# Altium project Telemetria_Oficial.PrjPcb
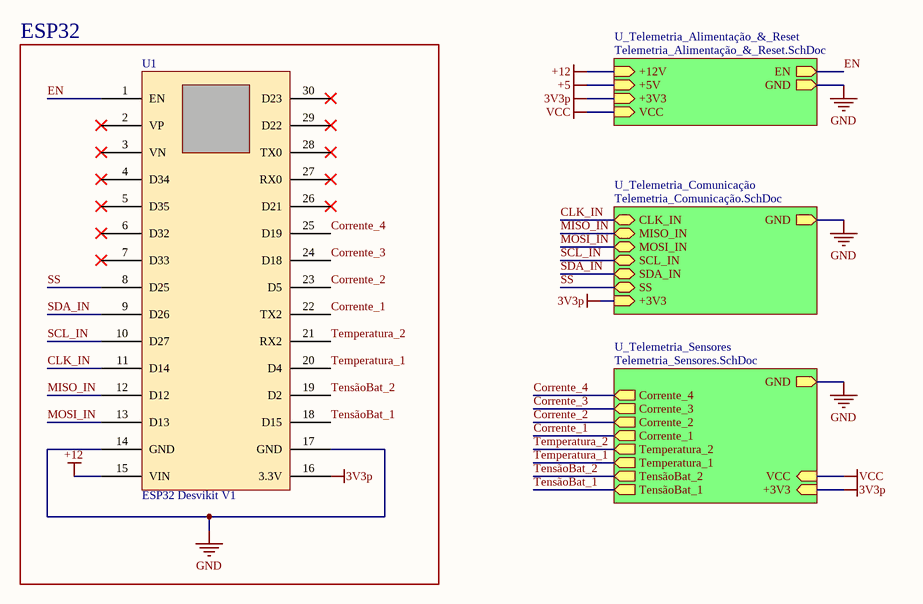
[diagram p0: Telemetria_Oficial.SchDoc]
4 sheets, 27 parts. Net scope: hierarchical (ports join the sheet entries above them; power ports are global).
Board file: Telemetria_Oficial.PcbDoc
Sheets:
  Telemetria_Oficial.SchDoc
    U_Telemetria_Alimentação_&_Reset = Telemetria_Alimentação_&_Reset.SchDoc
    U_Telemetria_Comunicação = Telemetria_Comunicação.SchDoc
    U_Telemetria_Sensores = Telemetria_Sensores.SchDoc

## Sheet Telemetria_Oficial.SchDoc
size A4; SheetNumber: 1; SheetTotal: 4

### Parts
U1  value ESP32 Desvikit V1  [ESP32_Desvikit_v1]  (hidden comment: microcontrolador)

### Blocks framed on the sheet
ESP32: U1

### Sub-sheets
U_Telemetria_Alimentação_&_Reset = Telemetria_Alimentação_&_Reset.SchDoc: EN (out), GND (out), +12V (in), +5V (in), +3V3 (in), VCC (in)
U_Telemetria_Comunicação = Telemetria_Comunicação.SchDoc: CLK_IN (bidir), MISO_IN (bidir), MOSI_IN (bidir), SCL_IN (bidir), SDA_IN (bidir), SS (bidir), GND (out), +3V3 (in)
U_Telemetria_Sensores = Telemetria_Sensores.SchDoc: TensãoBat_1 (out), TensãoBat_2 (out), Temperatura_1 (out), Temperatura_2 (out), Corrente_1 (out), Corrente_2 (out), Corrente_3 (out), Corrente_4 (out), GND (out), +3V3 (in), VCC (in)

### Nets
3V3p: U1.16(3.3V) ; sheet U_Telemetria_Alimentação_&_Reset/+3V3, sheet U_Telemetria_Comunicação/+3V3, sheet U_Telemetria_Sensores/+3V3  [project net +3V3]
+12: U1.15(VIN) ; sheet U_Telemetria_Alimentação_&_Reset/+12V  [project net +12V]
GND: U1.14(GND) U1.17(GND) ; sheet U_Telemetria_Alimentação_&_Reset/GND, sheet U_Telemetria_Comunicação/GND, sheet U_Telemetria_Sensores/GND
VCC: sheet U_Telemetria_Alimentação_&_Reset/VCC, sheet U_Telemetria_Sensores/VCC
CLK_IN: U1.11(D14) ; sheet U_Telemetria_Comunicação/CLK_IN
Corrente_1: U1.22(TX2) ; sheet U_Telemetria_Sensores/Corrente_1
Corrente_2: U1.23(D5) ; sheet U_Telemetria_Sensores/Corrente_2
Corrente_3: U1.24(D18) ; sheet U_Telemetria_Sensores/Corrente_3
Corrente_4: U1.25(D19) ; sheet U_Telemetria_Sensores/Corrente_4
EN: U1.1(EN) ; sheet U_Telemetria_Alimentação_&_Reset/EN
MISO_IN: U1.12(D12) ; sheet U_Telemetria_Comunicação/MISO_IN
MOSI_IN: U1.13(D13) ; sheet U_Telemetria_Comunicação/MOSI_IN
SCL_IN: U1.10(D27) ; sheet U_Telemetria_Comunicação/SCL_IN
SDA_IN: U1.9(D26) ; sheet U_Telemetria_Comunicação/SDA_IN
SS: U1.8(D25) ; sheet U_Telemetria_Comunicação/SS
Temperatura_1: U1.20(D4) ; sheet U_Telemetria_Sensores/Temperatura_1
Temperatura_2: U1.21(RX2) ; sheet U_Telemetria_Sensores/Temperatura_2
TensãoBat_1: U1.18(D15) ; sheet U_Telemetria_Sensores/TensãoBat_1
TensãoBat_2: U1.19(D2) ; sheet U_Telemetria_Sensores/TensãoBat_2

Not connected (* = marked no-connect by the designer): U1 2(VP)* 3(VN)* 4(D34)* 5(D35)* 6(D32)* 7(D33)* 26(D21)* 27(RX0)* 28(TX0)* 29(D22)* 30(D23)*

### Library data of the parts
U1 = ESP32 Desvikit v1: microcontrolador com moculo bluethoth e wifi

## Sheet Telemetria_Alimentação_&_Reset.SchDoc
size A4; SheetNumber: 2; SheetTotal: 4
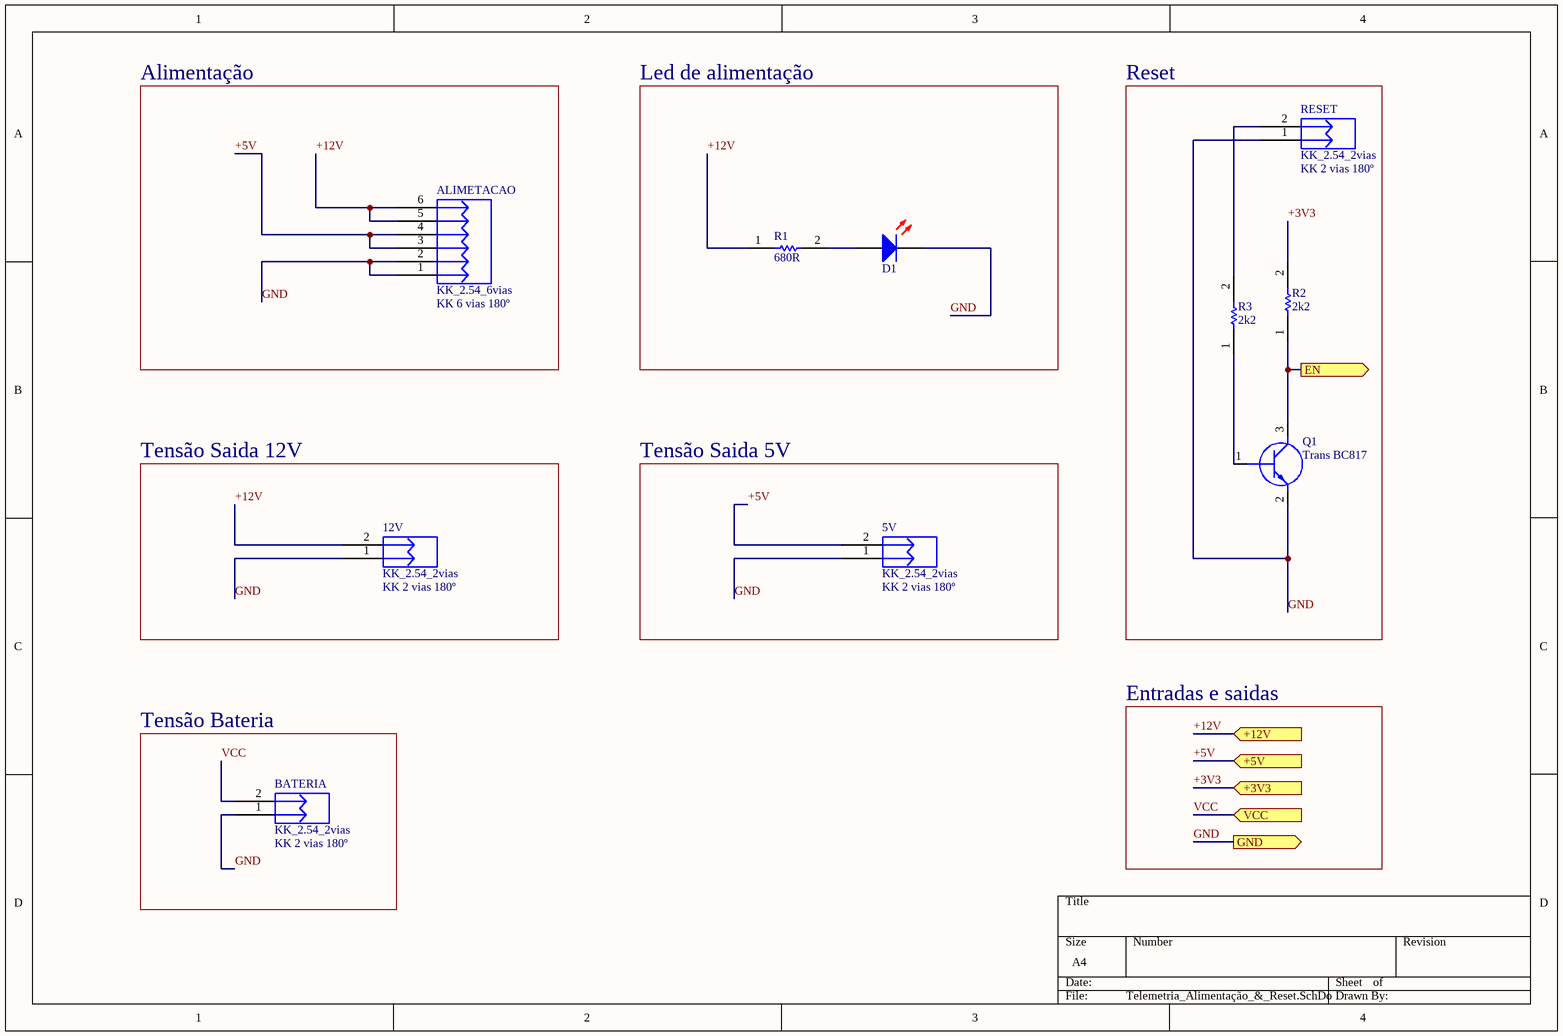
[diagram p1: Telemetria_Alimentação_&_Reset.SchDoc]

### Parts
5V  KK_2.54_2vias  Valor: KK 2 vias 180º  [KK_2VIAS_180º]
12V  KK_2.54_2vias  Valor: KK 2 vias 180º  [KK_2VIAS_180º]
ALIMETACAO  KK_2.54_6vias  Valor: KK 6 vias 180º  [KK_6vias_180°]
BATERIA  KK_2.54_2vias  Valor: KK 2 vias 180º  [KK_2VIAS_180º]
D1  LED 3MM RED  [LED RED]  (value not drawn)
Q1  Trans BC817  [SOT96P240X110-3N]
R1  680R  [RESC3216X60N]
R2  2k2  [RESC3216X60N]
R3  2k2  [RESC3216X60N]
RESET  KK_2.54_2vias  Valor: KK 2 vias 180º  [KK_2VIAS_180º]

### Blocks framed on the sheet
Alimentação: ALIMETACAO
Led de alimentação: D1 R1
Reset: Q1 R2 R3 RESET
Tensão Saida 12V: 12V
Tensão Saida 5V: 5V
Tensão Bateria: BATERIA

### Ports
+3V3 (in), +5V (in), +12V (in), EN (out), GND (out), VCC (in)

### Nets
+3V3: R2.2 ; port +3V3
+5V: 5V.2 ALIMETACAO.3 ALIMETACAO.4 ; port +5V
+12V: 12V.2 ALIMETACAO.5 ALIMETACAO.6 R1.1 ; port +12V
GND: 5V.1 12V.1 ALIMETACAO.1 ALIMETACAO.2 BATERIA.1 D1.2(K) Q1.2(E) RESET.1 ; port GND
VCC: BATERIA.2 ; port VCC
EN: Q1.3(C) R2.1 ; port EN
NetD1_1: D1.1(A) R1.2
NetQ1_1: Q1.1(B) R3.1
NetR3_2: R3.2 RESET.2

### Notes on the sheet
- Entradas e saidas

### Library data of the parts
5V 12V BATERIA RESET = KK_2.54_2vias: Conector KK 2.54mm 2 vias; Descrição: Conector KK 3 vias com passo 2.54mm; Encapsulamento: PTH - 180º; Modelo: 2 vias - 180º; Marca: *; Observação: *
ALIMETACAO = KK_2.54_6vias: Conector KK 2.54mm 6 vias; Descrição: Conector KK 3 vias com passo 2.54mm; Encapsulamento: PTH - 180º; Modelo: 3 vias - 180º; Marca: *; Observação: *
D1 = LED 3MM RED: Manufacturer: Paralight; Manufacturer Part Number: IMP585; Wavelength Typ: 625; Forward Voltage: 2; Forward Current If: 20; Luminous Intensity: 3; LED Mounting: Through Hole; Lens Shape: Round; Viewing Angle: 60°; SVHC: No SVHC (15-Jun-2015); External Diameter: 2.9; External Length / Height: 4.6; Forward Voltage VF Max: 2.5; LED / Lamp Size: 3mm / T-1; LED Type: Standard; Lead Cross-section Depth: 0.5; Luminous Intensity @ If Min: 0.7; PIV Max: 5; Peak Forward Current: 7; Voltage Vf Typ: 2.2V<!--FANDB--><div class="features-and-benefits-container"><div class="features-and-benefits-description"><span class="features-benefits-value">The L-934LID from Kingbright is a through hole round shape high efficiency red colour LED. The device is made of gallium arsenide phosphide on gallium phosphide orange light emitting diode. This LED is widely used because of low power consumption, long life and solid state reliability.</span></div><div class="features-and-benefits-list"><ul class="features-and-benefits-list-list"><li class="features-and-benefits-list-item">Standard bulb size of T-1 (3mm)</li><li class="features-and-benefits-list-item">Reliable and rugged</li><li class="features-and-benefits-list-item">Viewing angle is 60°</li><li class="features-and-benefits-list-item">Luminous intensity of 3mcd at 2mA</li><li class="features-and-benefits-list-item">Forward voltage is 2.0V</li><li class="features-and-benefits-list-item">Forward current (If) is 20mA</li><li class="features-and-benefits-list-item">Dominant wavelength is 625nm at IF=20mA</li><li class="features-and-benefits-list-item">Peak wavelength is 627nm at IF=20; Supplier 1: Mult Comercial; RoHS: YES; Stock 1: 35260; Pricing 1: 1=0.15 (BRL); LED Colour: Red; Bulb Size: 3mm; Packaging: Each; MSL: -; Current If Luminous Intensity: 2; Dominant Wavelength: 625; Forward Current If Max: 20; Lead Cross-section Width: 0.5; Lead Spacing: 2.54; Luminous Intensity Typ: 3; Mounting Type: PCB Through Hole; No. of Pins: 2; Operating Temperature Max: 85; Operating Temperature Min: -40; Operating Temperature Range: -40°C to +85; Peak Wavelength: 625; ComponentLink1URL: http://loja.multcomercial.com.br/led-3mm-vermelho-difuso-l-314hd-paralight.html; ComponentLink1Description: http://loja.multcomercial.com.br/led-3mm-vermelho-difuso-l-314hd-paralight.html; Supplier Part Number 1: Led 3mm Vermelho Difuso L-314HD - Paralight
Q1 = Trans BC817: Transistor BJT NPN BC817-25-7-F; Manufacturer_Name: Diodes Inc.; Datasheet Link: https://www.diodes.com/assets/Datasheets/ds11107.pdf; Height: 1.1mm; Manufacturer_Part_Number: BC817-25-7-F; Mouser Part Number: 621-BC817-25-7-F; Mouser Price/Stock: https://www.mouser.co.uk/ProductDetail/Diodes-Incorporated/BC817-25-7-F?qs=rGAXPo9uwV0jK0EyLZnqOw%3D%3D; Arrow Part Number: BC817-25-7-F; Arrow Price/Stock: https://www.arrow.com/en/products/bc817-25-7-f/diodes-incorporated
R1-R3 = Resistor 1206: Resistor; Manufacturer_Name: Vishay; Manufacturer_Part_Number: CRCW12064K70FKEA; Datasheet Link: http://docs-emea.rs-online.com/webdocs/13ec/0900766b813ecc08.pdf; Height: 0.6mm; Mouser Part Number: 71-CRCW1206-4.7K-E3; Mouser Price/Stock: https://www.mouser.co.uk/ProductDetail/Vishay-Dale/CRCW12064K70FKEA?qs=1vm4qhDHCvlKJmatsKzyFQ%3D%3D; Arrow Part Number: CRCW12064K70FKEA; Arrow Price/Stock: https://www.arrow.com/en/products/crcw12064k70fkea/vishay

## Sheet Telemetria_Comunicação.SchDoc
size A4; SheetNumber: 3; SheetTotal: 4
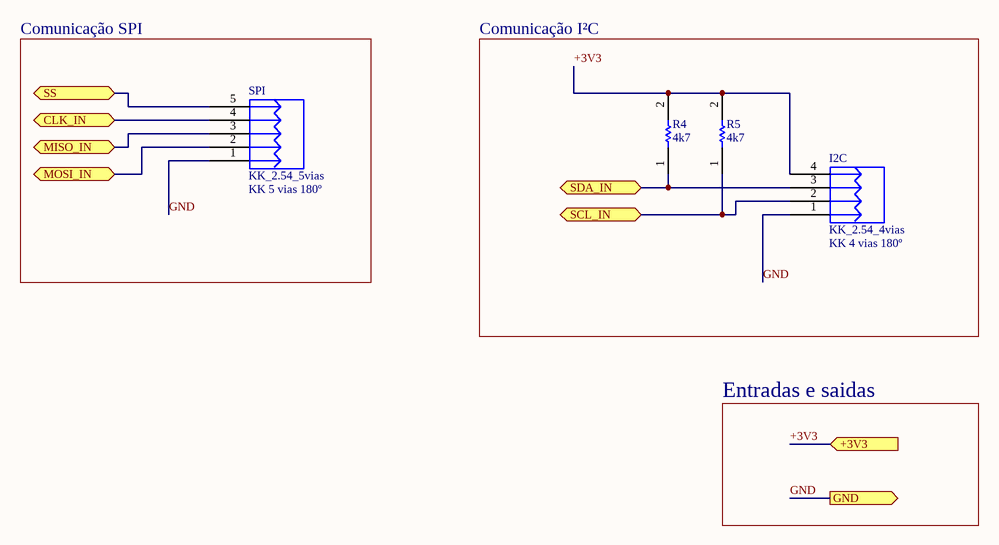
[diagram p2: Telemetria_Comunicação.SchDoc]

### Parts
I2C  KK_2.54_4vias  Valor: KK 4 vias 180º  [KK_4vias_180°]
R4  4k7  [RESC3216X60N]
R5  4k7  [RESC3216X60N]
SPI  KK_2.54_5vias  Valor: KK 5 vias 180º  [KK_5vias_180°]

### Blocks framed on the sheet
Comunicação SPI: SPI
Comunicação I²C: I2C R4 R5

### Ports
+3V3 (in), CLK_IN (bidir), GND (out), MISO_IN (bidir), MOSI_IN (bidir), SCL_IN (bidir), SDA_IN (bidir), SS (bidir)

### Nets
+3V3: I2C.4 R4.2 R5.2 ; port +3V3
GND: I2C.1 SPI.1 ; port GND
CLK_IN: SPI.4 ; port CLK_IN
MISO_IN: SPI.3 ; port MISO_IN
MOSI_IN: SPI.2 ; port MOSI_IN
SCL_IN: I2C.2 R5.1 ; port SCL_IN
SDA_IN: I2C.3 R4.1 ; port SDA_IN
SS: SPI.5 ; port SS

### Notes on the sheet
- Entradas e saidas

### Library data of the parts
I2C = KK_2.54_4vias: Conector KK 2.54mm 4 vias; Descrição: Conector KK 3 vias com passo 2.54mm; Encapsulamento: PTH - 180º; Modelo: 3 vias - 180º; Marca: *; Observação: *
R4 R5 = Resistor 1206: as R1 on sheet Telemetria_Alimentação_&_Reset; Datasheet Link: http://docs-emea.rs-online.com/webdocs/13ec/0900766b813ecc08.pdf; Height: 0.6mm; Mouser Part Number: 71-CRCW1206-4.7K-E3; Mouser Price/Stock: https://www.mouser.co.uk/ProductDetail/Vishay-Dale/CRCW12064K70FKEA?qs=1vm4qhDHCvlKJmatsKzyFQ%3D%3D; Arrow Part Number: CRCW12064K70FKEA; Arrow Price/Stock: https://www.arrow.com/en/products/crcw12064k70fkea/vishay
SPI = KK_2.54_5vias: Conector KK 2.54mm 5 vias; Descrição: Conector KK 3 vias com passo 2.54mm; Encapsulamento: PTH - 180º; Modelo: 3 vias - 180º; Marca: *; Observação: *

## Sheet Telemetria_Sensores.SchDoc
size A4; SheetNumber: 4; SheetTotal: 4
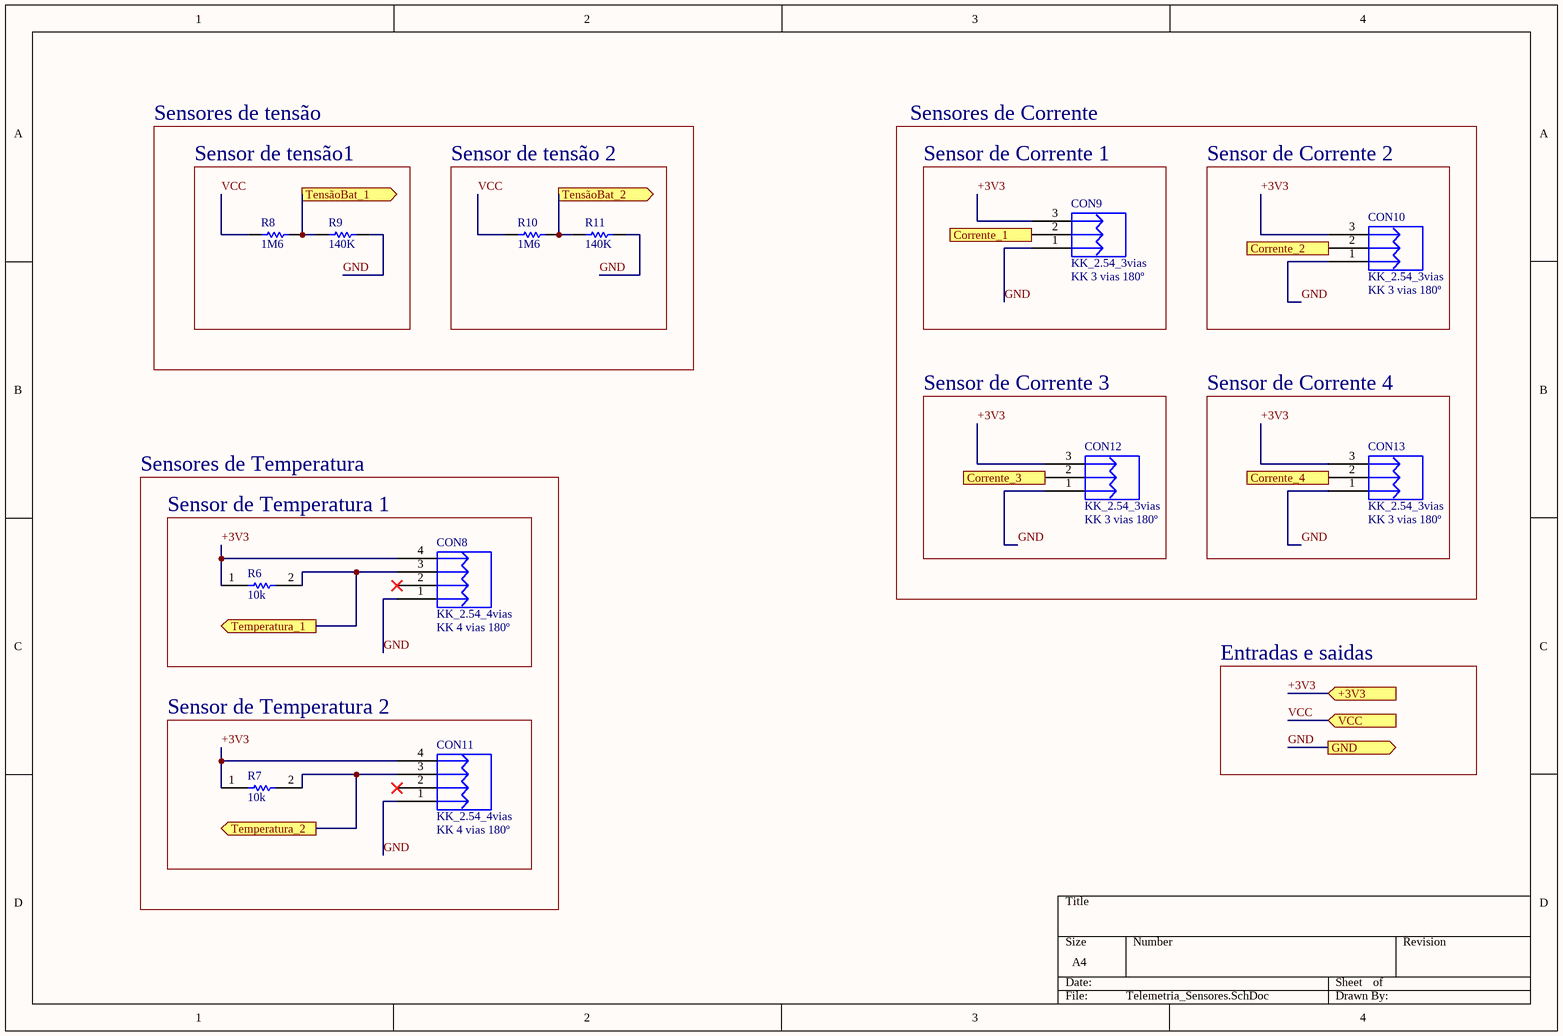
[diagram p3: Telemetria_Sensores.SchDoc]

### Parts
CON8  KK_2.54_4vias  Valor: KK 4 vias 180º  [KK_4vias_180°]
CON9  KK_2.54_3vias  Valor: KK 3 vias 180º  [KK_3vias_180º]
CON10  KK_2.54_3vias  Valor: KK 3 vias 180º  [KK_3vias_180º]
CON11  KK_2.54_4vias  Valor: KK 4 vias 180º  [KK_4vias_180°]
CON12  KK_2.54_3vias  Valor: KK 3 vias 180º  [KK_3vias_180º]
CON13  KK_2.54_3vias  Valor: KK 3 vias 180º  [KK_3vias_180º]
R6  10k  [RESC3216X60N]
R7  10k  [RESC3216X60N]
R8  1M6  [RESISTOR 0603]
R9  140K  [RESISTOR 0805]
R10  1M6  [RESISTOR 0603]
R11  140K  [RESISTOR 0805]

### Blocks framed on the sheet
Sensor de tensão1: R8 R9
Sensor de tensão 2: R10 R11
Sensor de Corrente 1: CON9
Sensor de Corrente 2: CON10
Sensor de Corrente 3: CON12
Sensor de Corrente 4: CON13
Sensor de Temperatura 1: CON8 R6
Sensor de Temperatura 2: CON11 R7

### Ports
+3V3 (in), Corrente_1 (out), Corrente_2 (out), Corrente_3 (out), Corrente_4 (out), GND (out), Temperatura_1 (out), Temperatura_2 (out), TensãoBat_1 (out), TensãoBat_2 (out), VCC (in)

### Nets
+3V3: CON8.4 CON9.3 CON10.3 CON11.4 CON12.3 CON13.3 R6.1 R7.1 ; port +3V3
GND: CON8.1 CON9.1 CON10.1 CON11.1 CON12.1 CON13.1 R9.2 R11.2 ; port GND
VCC: R8.1 R10.1 ; port VCC
Corrente_1: CON9.2 ; port Corrente_1
Corrente_2: CON10.2 ; port Corrente_2
Corrente_3: CON12.2 ; port Corrente_3
Corrente_4: CON13.2 ; port Corrente_4
Temperatura_1: CON8.3 R6.2 ; port Temperatura_1
Temperatura_2: CON11.3 R7.2 ; port Temperatura_2
TensãoBat_1: R8.2 R9.1 ; port TensãoBat_1
TensãoBat_2: R10.2 R11.1 ; port TensãoBat_2

Not connected (* = marked no-connect by the designer): CON8 2*; CON11 2*

### Notes on the sheet
- Sensores de tensão
- Sensores de Corrente
- Sensores de Temperatura
- Entradas e saidas

### Library data of the parts
CON8 CON11 = KK_2.54_4vias: as I2C on sheet Telemetria_Comunicação; Marca: *; Observação: *
CON9 CON10 CON12 CON13 = KK_2.54_3vias: Conector KK 2.54mm 3 vias; Descrição: Conector KK 3 vias com passo 2.54mm; Encapsulamento: PTH - 180º; Modelo: 3 vias - 180º; Marca: *; Observação: *
R6 R7 = Resistor 1206: as R1 on sheet Telemetria_Alimentação_&_Reset; Datasheet Link: http://docs-emea.rs-online.com/webdocs/13ec/0900766b813ecc08.pdf; Height: 0.6mm; Mouser Part Number: 71-CRCW1206-4.7K-E3; Mouser Price/Stock: https://www.mouser.co.uk/ProductDetail/Vishay-Dale/CRCW12064K70FKEA?qs=1vm4qhDHCvlKJmatsKzyFQ%3D%3D; Arrow Part Number: CRCW12064K70FKEA; Arrow Price/Stock: https://www.arrow.com/en/products/crcw12064k70fkea/vishay
R8 R10 = RES 0603 5%: 0603; Manufacturer: PANASONIC ELECTRONIC COMPONENTS; Manufacturer Part Number: ERJ-3GEY0R00V; Product Range: AEC-Q200 ERJ3; Resistance: 0; Power Rating: 100; Voltage Rating: 75; Resistor Case Style: 0603 [1608 Metric]; Resistance (Ohms): 0.0; Tolerance: Jumper; Power (Watts): 0.1W, 1/10W; Brand: Panasonic; Qualification: AEC-Q200; RoHS: YES; Resistance Tolerance: -; Packaging: Cut Tape; MSL: -; ComponentLink1URL: http://www.farnell.com/cad/1697908.zip; ComponentLink1Description: http://www.farnell.com/cad/1697908.zip; ComponentLink2URL: http://www.farnell.com/datasheets/1678796.pdf; ComponentLink2Description: http://www.farnell.com/datasheets/1678796.pdf; Category: Resistors; Composition: Thick Film; Features: Automotive AEC-Q200; Temperature Coefficient: -; Operating Temperature: -55°C ~ 155°C; Package / Case: 0603 (1608 Metric); Supplier Device Package: 0603; Size / Dimension: 0.063" L x 0.031" W (1.60mm x 0.80mm); Height: 0.022" (0.55mm); Number of Terminations: 2; ComponentLink3URL: http://industrial.panasonic.com/www-cgi/jvcr13pz.cgi?E+PZ+3+AOA0001+ERJ3GEY0R00V+7+WW; ComponentLink3Description: http://industrial.panasonic.com/www-cgi/jvcr13pz.cgi?E+PZ+3+AOA0001+ERJ3GEY0R00V+7+WW; Supplier 1: Mouser; Stock 1: 1987085; Pricing 1: 1=0.160, 10=0.019, 100=0.013, 500=0.010, 1000=0.005, 5000=0.003 (AUD); Length: 1.6 mm; Operating Temperature Range: - 55 C to + 155 C; Product: Thick Film Resistors Zero-Ohm; Series: ERJ; Termination Style: SMD/SMT; Type: Thick Film Resistors SMD; Width: 0.8 mm; Case Code - in: 0603; Case Code - mm: 1608; RoHS - Mouser: E; Minimum Order Quantity: 1; Reeling: True; ComponentLink4URL: http://www.mouser.com/ds/2/315/AOA0000C84-947596.pdf; ComponentLink4Description: http://www.mouser.com/ds/2/315/AOA0000C84-947596.pdf; Supplier Part Number 1: 667-ERJ-3GEY0R00V
R9 R11 = RES 0805 5%: 0805; Manufacturer: PANASONIC ELECTRONIC COMPONENTS; Manufacturer Part Number: ERJ-3GEY0R00V; Product Range: AEC-Q200 ERJ3; Resistance: 0; Power Rating: 100; Voltage Rating: 75; Resistor Case Style: 0603 [1608 Metric]; Resistance (Ohms): 0.0; Tolerance: Jumper; Power (Watts): 0.1W, 1/10W; Brand: Panasonic; Qualification: AEC-Q200; RoHS: YES; Resistance Tolerance: -; Packaging: Cut Tape; MSL: -; ComponentLink1URL: http://www.farnell.com/cad/1697908.zip; ComponentLink1Description: http://www.farnell.com/cad/1697908.zip; ComponentLink2URL: http://www.farnell.com/datasheets/1678796.pdf; ComponentLink2Description: http://www.farnell.com/datasheets/1678796.pdf; Category: Resistors; Composition: Thick Film; Features: Automotive AEC-Q200; Temperature Coefficient: -; Operating Temperature: -55°C ~ 155°C; Package / Case: 0603 (1608 Metric); Supplier Device Package: 0603; Size / Dimension: 0.063" L x 0.031" W (1.60mm x 0.80mm); Height: 0.022" (0.55mm); Number of Terminations: 2; ComponentLink3URL: http://industrial.panasonic.com/www-cgi/jvcr13pz.cgi?E+PZ+3+AOA0001+ERJ3GEY0R00V+7+WW; ComponentLink3Description: http://industrial.panasonic.com/www-cgi/jvcr13pz.cgi?E+PZ+3+AOA0001+ERJ3GEY0R00V+7+WW; Supplier 1: Mouser; Stock 1: 1987085; Pricing 1: 1=0.160, 10=0.019, 100=0.013, 500=0.010, 1000=0.005, 5000=0.003 (AUD); Length: 1.6 mm; Operating Temperature Range: - 55 C to + 155 C; Product: Thick Film Resistors Zero-Ohm; Series: ERJ; Termination Style: SMD/SMT; Type: Thick Film Resistors SMD; Width: 0.8 mm; Case Code - in: 0603; Case Code - mm: 1608; RoHS - Mouser: E; Minimum Order Quantity: 1; Reeling: True; ComponentLink4URL: http://www.mouser.com/ds/2/315/AOA0000C84-947596.pdf; ComponentLink4Description: http://www.mouser.com/ds/2/315/AOA0000C84-947596.pdf; Supplier Part Number 1: 667-ERJ-3GEY0R00V

## Nets that join several sheets
+3V3: Telemetria_Oficial (U1.16), Telemetria_Alimentação_&_Reset (R2.2), Telemetria_Comunicação (I2C.4 R4.2 R5.2), Telemetria_Sensores (8 pins)
+12V: Telemetria_Oficial (U1.15), Telemetria_Alimentação_&_Reset (12V.2 ALIMETACAO.5 ALIMETACAO.6 R1.1)
GND: Telemetria_Oficial (U1.14 U1.17), Telemetria_Alimentação_&_Reset (8 pins), Telemetria_Comunicação (I2C.1 SPI.1), Telemetria_Sensores (8 pins)
VCC: Telemetria_Alimentação_&_Reset (BATERIA.2), Telemetria_Sensores (R8.1 R10.1)
CLK_IN: Telemetria_Oficial (U1.11), Telemetria_Comunicação (SPI.4)
Corrente_1: Telemetria_Oficial (U1.22), Telemetria_Sensores (CON9.2)
Corrente_2: Telemetria_Oficial (U1.23), Telemetria_Sensores (CON10.2)
Corrente_3: Telemetria_Oficial (U1.24), Telemetria_Sensores (CON12.2)
Corrente_4: Telemetria_Oficial (U1.25), Telemetria_Sensores (CON13.2)
EN: Telemetria_Oficial (U1.1), Telemetria_Alimentação_&_Reset (Q1.3 R2.1)
MISO_IN: Telemetria_Oficial (U1.12), Telemetria_Comunicação (SPI.3)
MOSI_IN: Telemetria_Oficial (U1.13), Telemetria_Comunicação (SPI.2)
SCL_IN: Telemetria_Oficial (U1.10), Telemetria_Comunicação (I2C.2 R5.1)
SDA_IN: Telemetria_Oficial (U1.9), Telemetria_Comunicação (I2C.3 R4.1)
SS: Telemetria_Oficial (U1.8), Telemetria_Comunicação (SPI.5)
Temperatura_1: Telemetria_Oficial (U1.20), Telemetria_Sensores (CON8.3 R6.2)
Temperatura_2: Telemetria_Oficial (U1.21), Telemetria_Sensores (CON11.3 R7.2)
TensãoBat_1: Telemetria_Oficial (U1.18), Telemetria_Sensores (R8.2 R9.1)
TensãoBat_2: Telemetria_Oficial (U1.19), Telemetria_Sensores (R10.2 R11.1)